# Altium project VoIP.PrjPcb
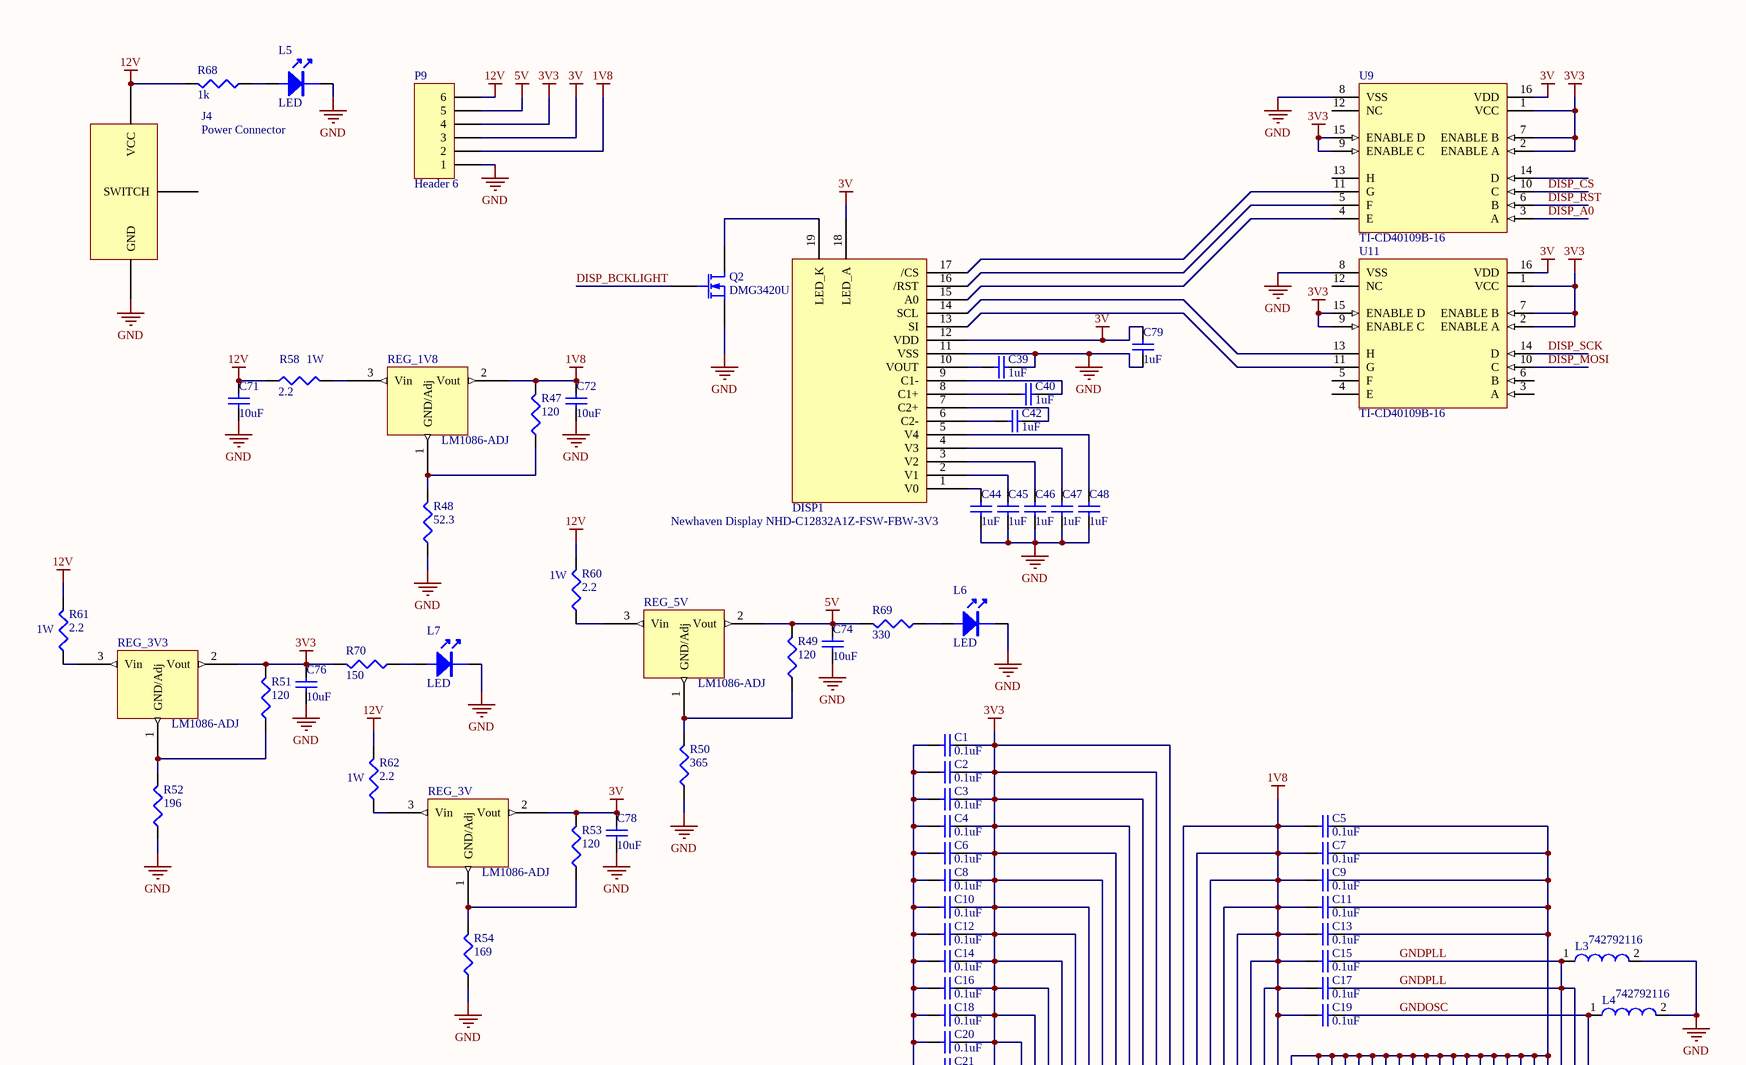
[diagram p0: Main.SchDoc, top left]
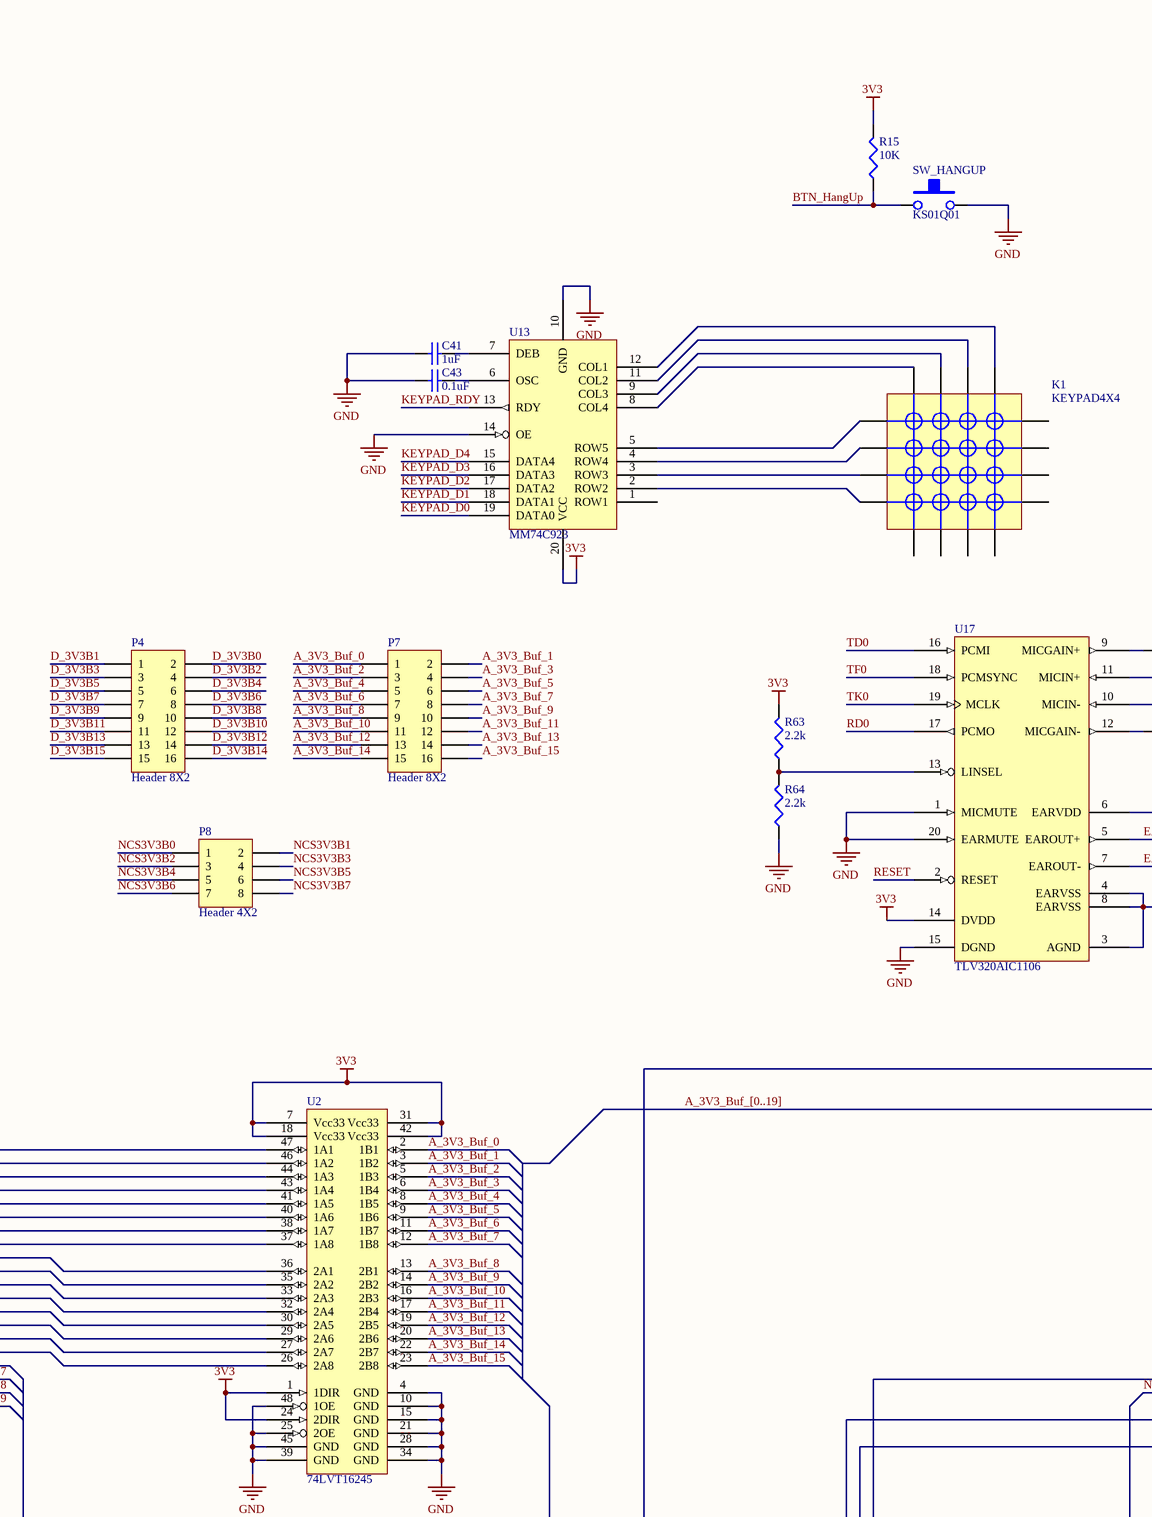
[diagram p1: Main.SchDoc, top middle]
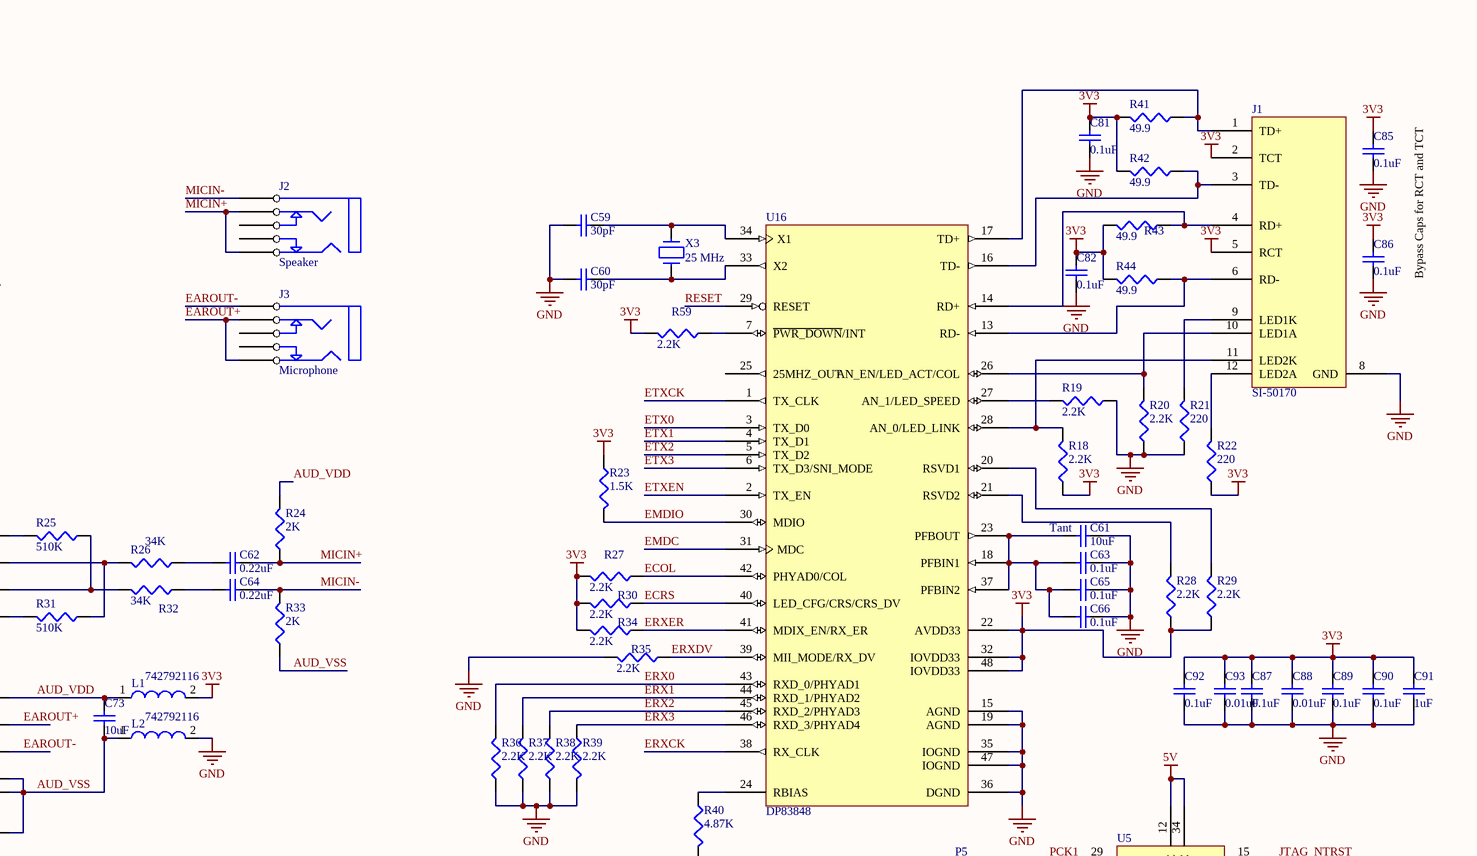
[diagram p2: Main.SchDoc, top right]
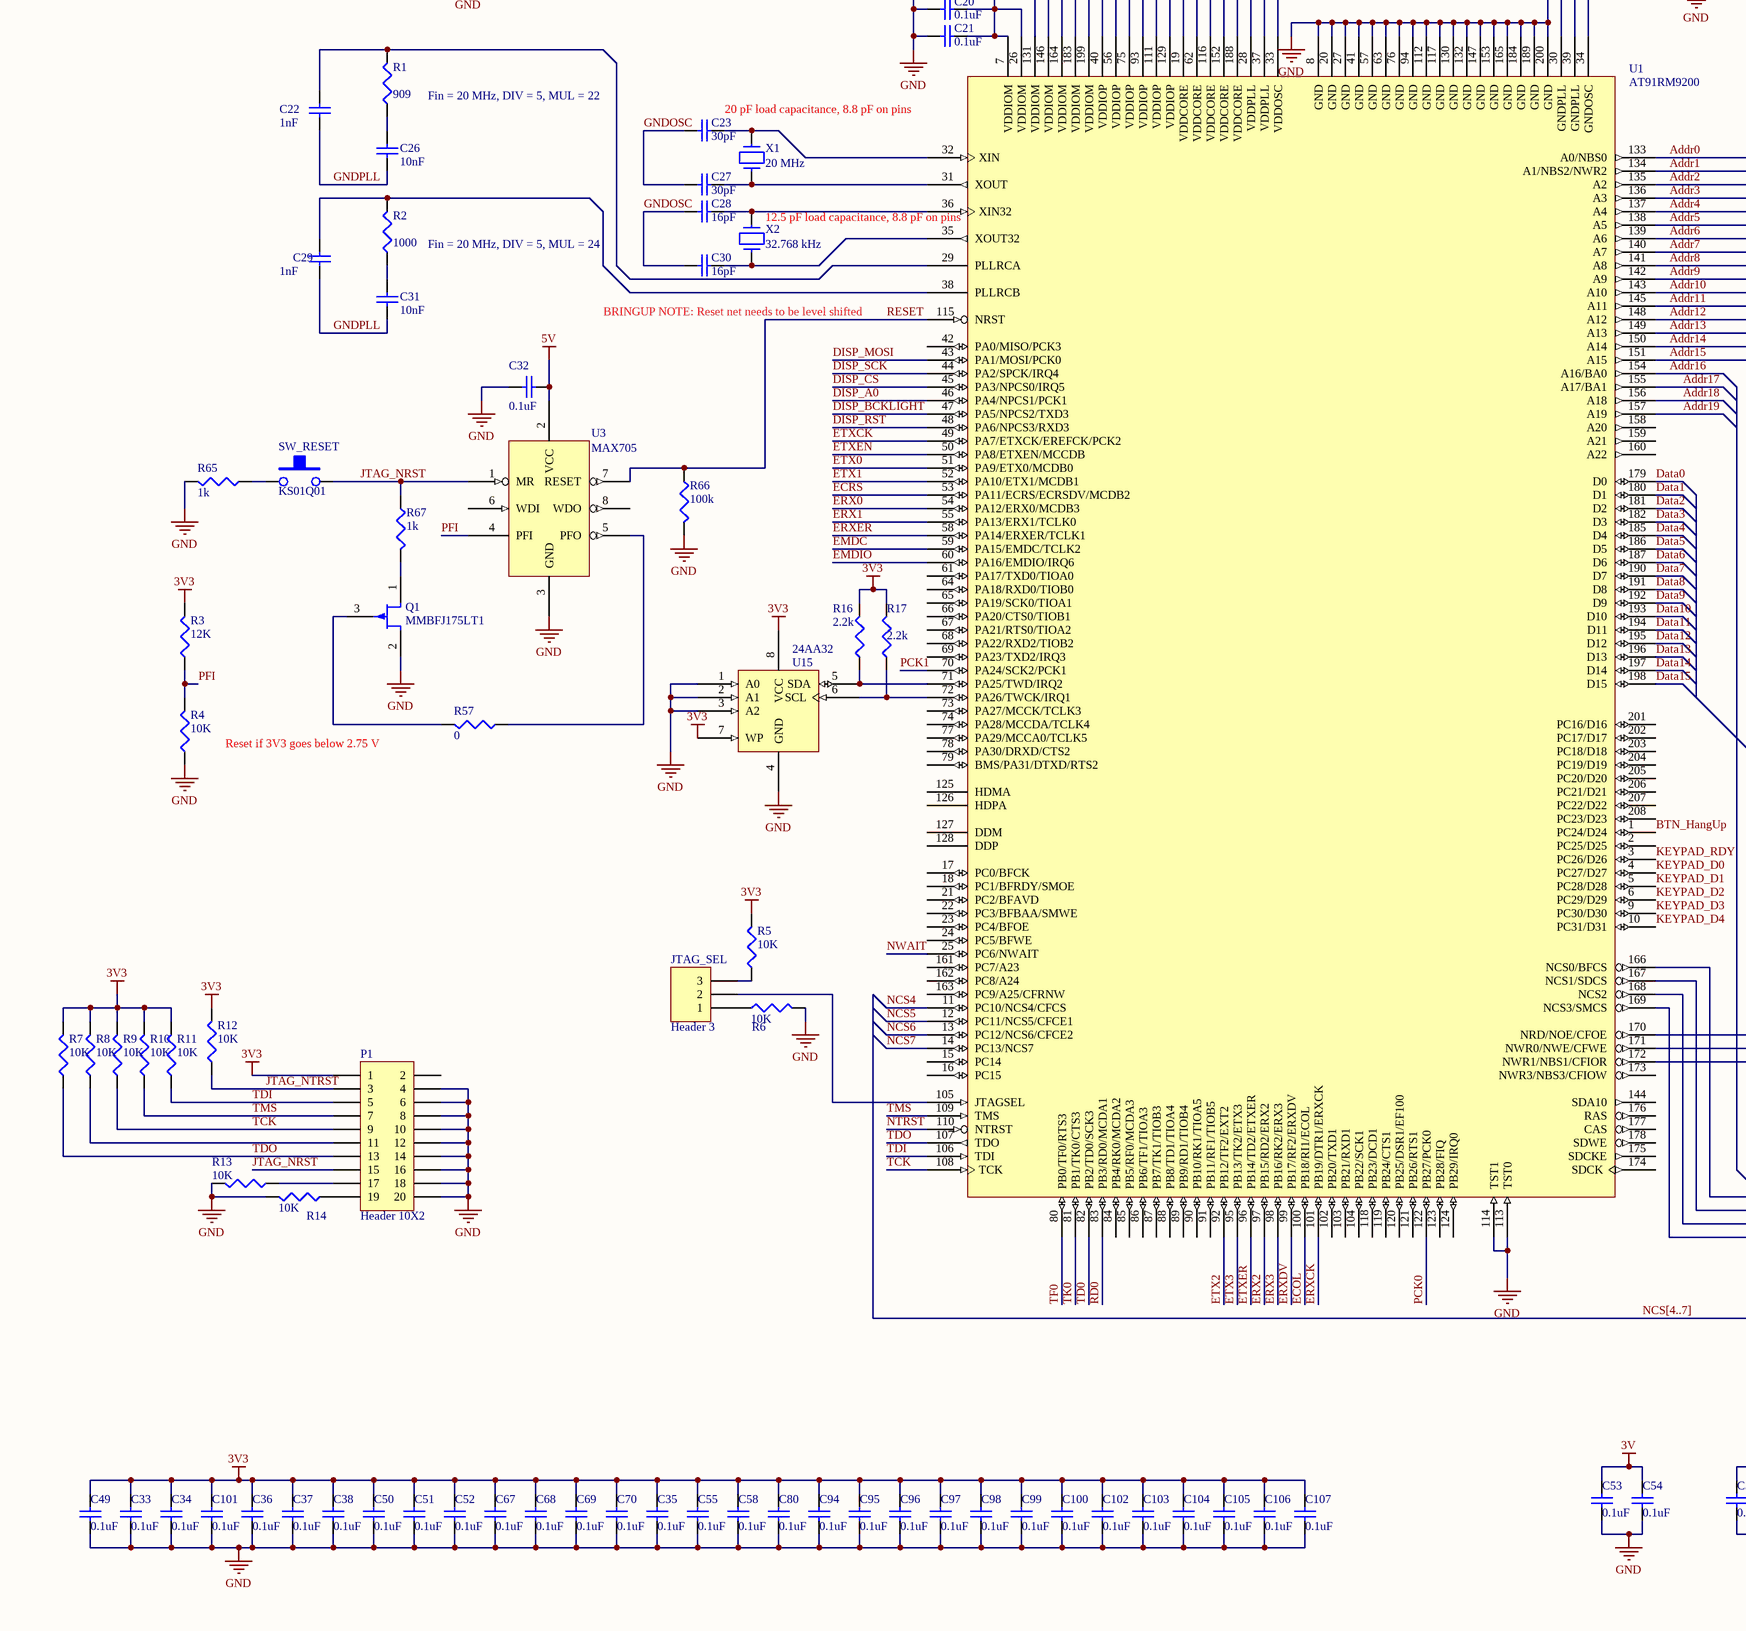
[diagram p3: Main.SchDoc, bottom left]
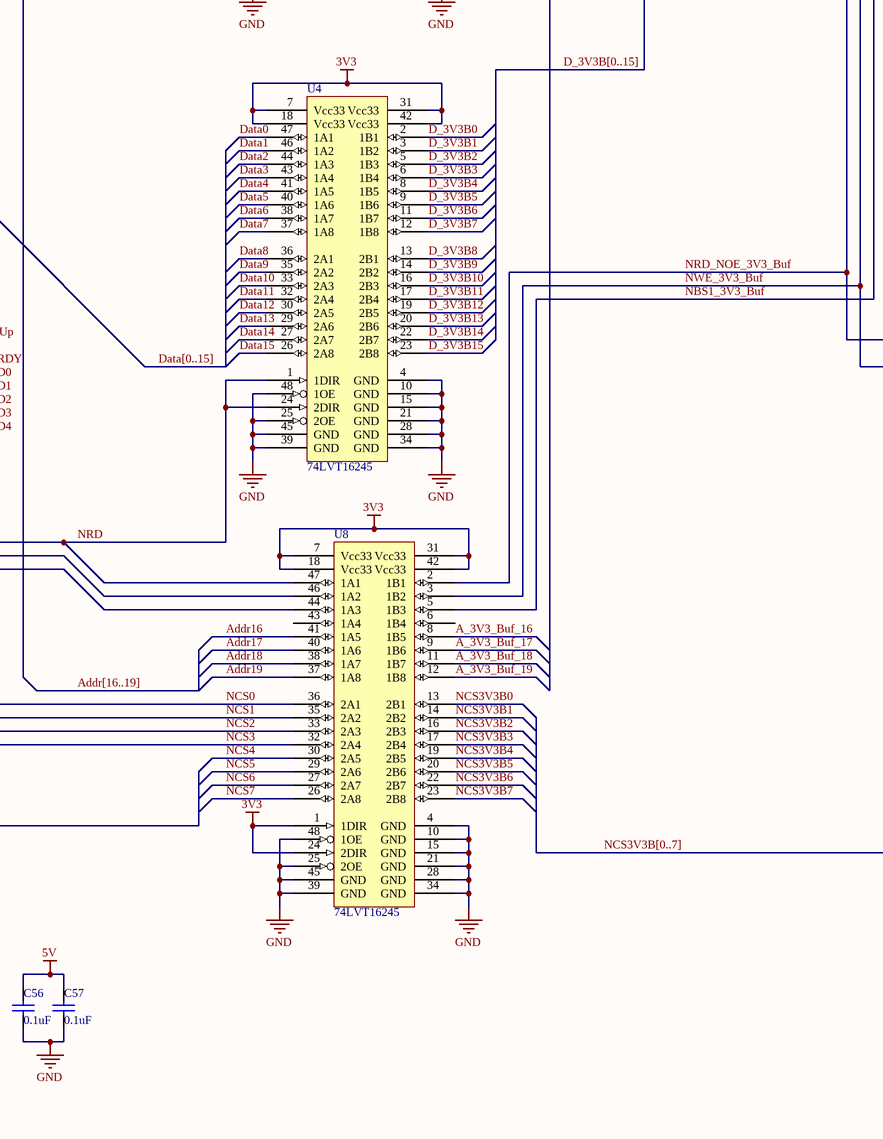
[diagram p4: Main.SchDoc, bottom middle]
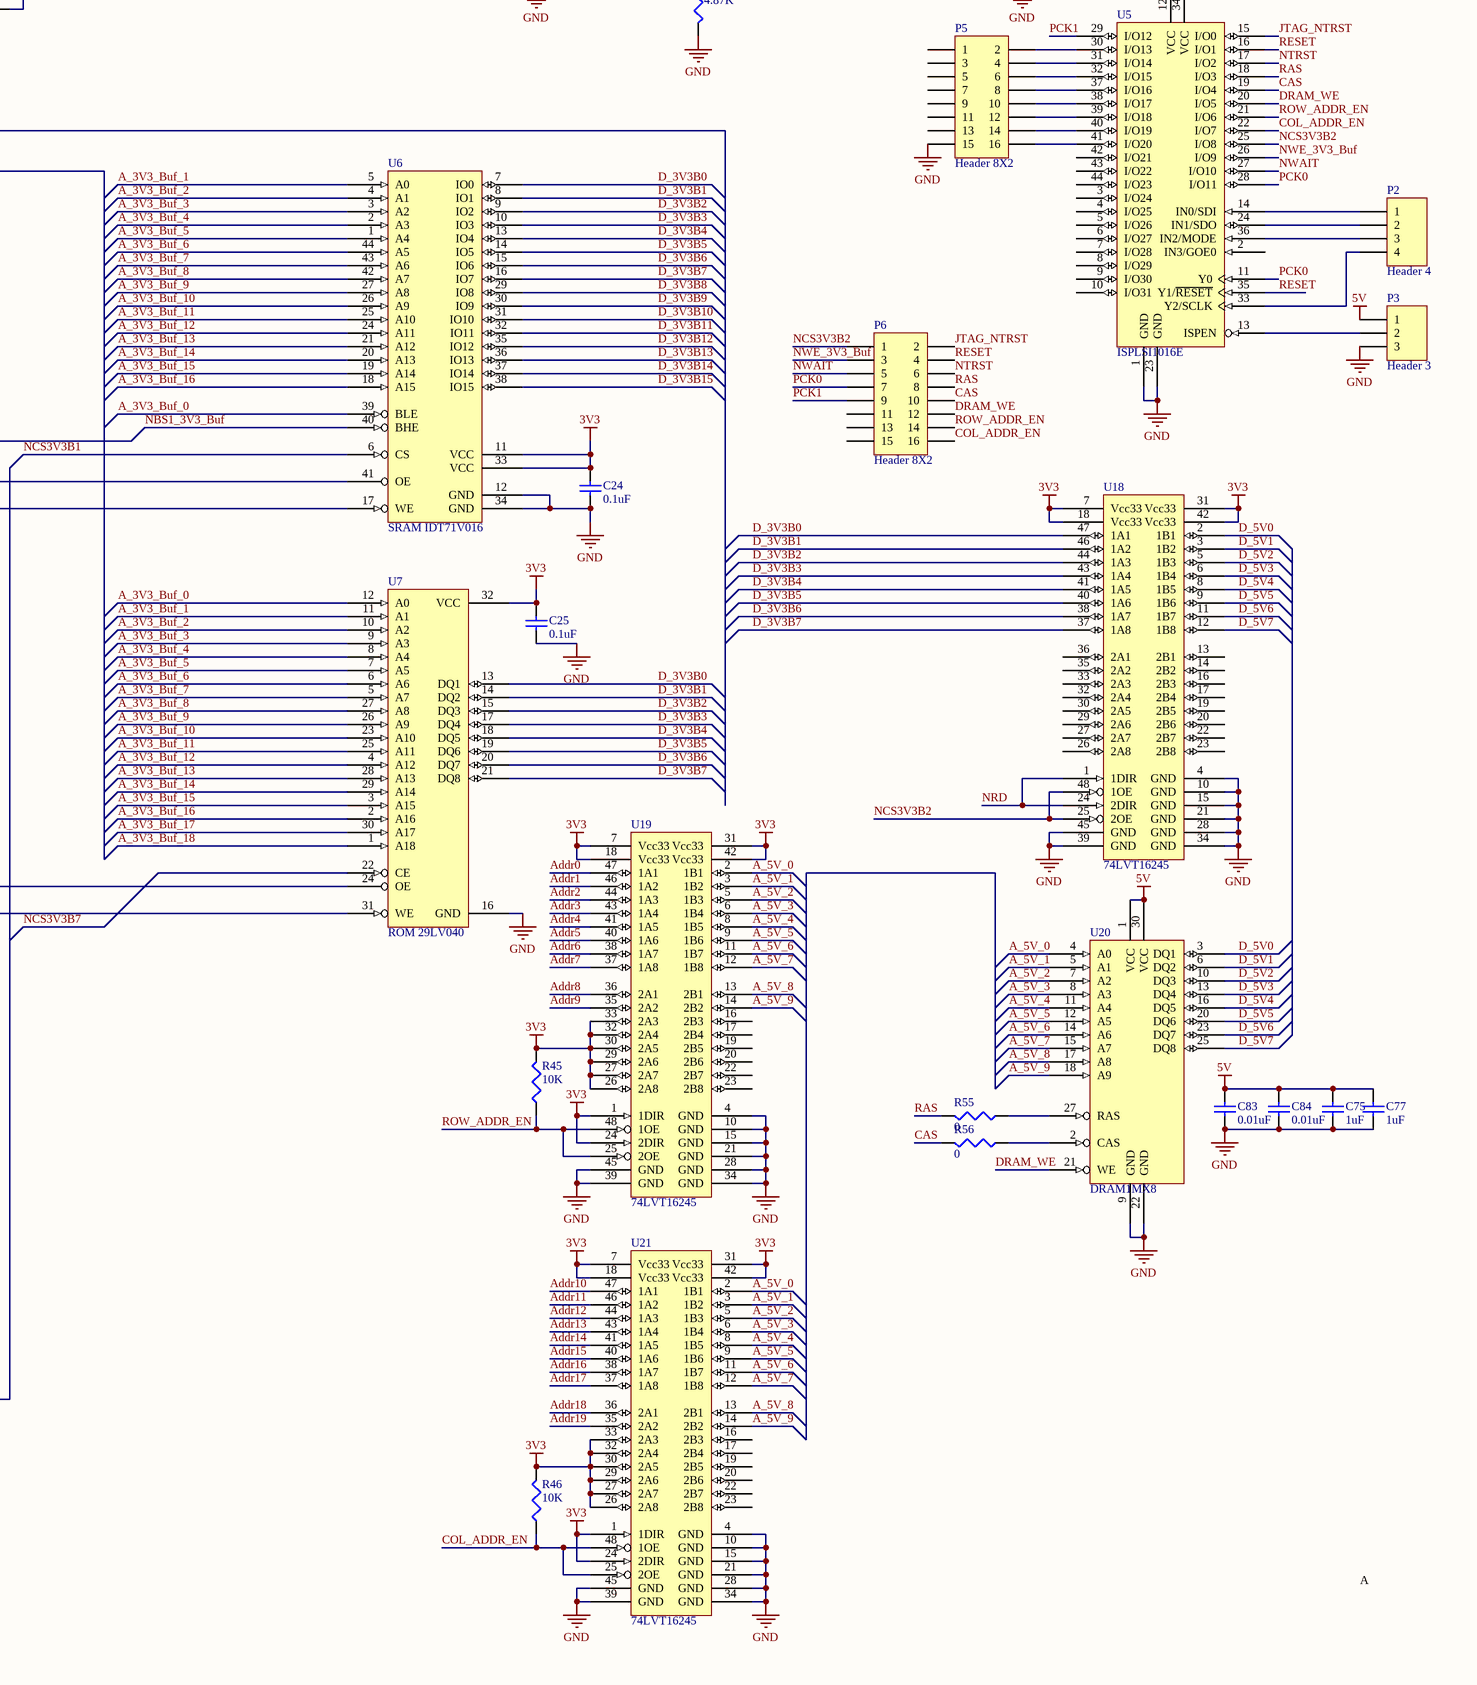
[diagram p5: Main.SchDoc, bottom right]
1 sheet, 229 parts. Net scope: global (net labels, ports and power ports of the same name join across sheets).
Board file: PCB.PcbDoc

## Sheet Main.SchDoc: Main
size D; Author: Will Werst; CompanyName: Caltech EE/CS 52; SheetNumber: 1; SheetTotal: 1

### Parts
C1  value 0.1uF  [1608[0603]]
C2  value 0.1uF  [1608[0603]]
C3  value 0.1uF  [1608[0603]]
C4  value 0.1uF  [1608[0603]]
C5  value 0.1uF  [1608[0603]]
C6  value 0.1uF  [1608[0603]]
C7  value 0.1uF  [1608[0603]]
C8  value 0.1uF  [1608[0603]]
C9  value 0.1uF  [1608[0603]]
C10  value 0.1uF  [1608[0603]]
C11  value 0.1uF  [1608[0603]]
C12  value 0.1uF  [1608[0603]]
C13  value 0.1uF  [1608[0603]]
C14  value 0.1uF  [1608[0603]]
C15  value 0.1uF  [1608[0603]]
C16  value 0.1uF  [1608[0603]]
C17  value 0.1uF  [1608[0603]]
C18  value 0.1uF  [1608[0603]]
C19  value 0.1uF  [1608[0603]]
C20  value 0.1uF  [1608[0603]]
C21  value 0.1uF  [1608[0603]]
C22  value 1nF  [1608[0603]]
C23  value 30pF  [1608[0603]]
C24  value 0.1uF  [1608[0603]]
C25  value 0.1uF  [1608[0603]]
C26  value 10nF  [1608[0603]]
C27  value 30pF  [1608[0603]]
C28  value 16pF  [1608[0603]]
C29  value 1nF  [1608[0603]]
C30  value 16pF  [1608[0603]]
C31  value 10nF  [1608[0603]]
C32  value 0.1uF  [1608[0603]]
C33  value 0.1uF  [1608[0603]]
C34  value 0.1uF  [1608[0603]]
C35  value 0.1uF  [1608[0603]]
C36  value 0.1uF  [1608[0603]]
C37  value 0.1uF  [1608[0603]]
C38  value 0.1uF  [1608[0603]]
C39  value 1uF  [1608[0603]]
C40  value 1uF  [1608[0603]]
C41  value 1uF  [1608[0603]]
C42  value 1uF  [1608[0603]]
C43  value 0.1uF  [1608[0603]]
C44  value 1uF  [1608[0603]]
C45  value 1uF  [1608[0603]]
C46  value 1uF  [1608[0603]]
C47  value 1uF  [1608[0603]]
C48  value 1uF  [1608[0603]]
C49  value 0.1uF  [1608[0603]]
C50  value 0.1uF  [1608[0603]]
C51  value 0.1uF  [1608[0603]]
C52  value 0.1uF  [1608[0603]]
C53  value 0.1uF  [1608[0603]]
C54  value 0.1uF  [1608[0603]]
C55  value 0.1uF  [1608[0603]]
C56  value 0.1uF  [1608[0603]]
C57  value 0.1uF  [1608[0603]]
C58  value 0.1uF  [1608[0603]]
C59  value 30pF  [1608[0603]]
C60  value 30pF  [1608[0603]]
C61  Tant  value 10uF  [C1206]
C62  value 0.22uF  [1608[0603]]
C63  value 0.1uF  [1608[0603]]
C64  value 0.22uF  [1608[0603]]
C65  value 0.1uF  [1608[0603]]
C66  value 0.1uF  [1608[0603]]
C67  value 0.1uF  [1608[0603]]
C68  value 0.1uF  [1608[0603]]
C69  value 0.1uF  [1608[0603]]
C70  value 0.1uF  [1608[0603]]
C71  value 10uF  [C1206]
C72  value 10uF  [C1206]
C73  value 10uF  [C1206]
C74  value 10uF  [C1206]
C75  value 1uF  [1608[0603]]
C76  value 10uF  [C1206]
C77  value 1uF  [1608[0603]]
C78  value 10uF  [C1206]
C79  value 1uF  [1608[0603]]
C80  value 0.1uF  [1608[0603]]
C81  value 0.1uF  [1608[0603]]
C82  value 0.1uF  [1608[0603]]
C83  value 0.01uF  [1608[0603]]
C84  value 0.01uF  [1608[0603]]
C85  value 0.1uF  [1608[0603]]
C86  value 0.1uF  [1608[0603]]
C87  value 0.1uF  [1608[0603]]
C88  value 0.01uF  [1608[0603]]
C89  value 0.1uF  [1608[0603]]
C90  value 0.1uF  [1608[0603]]
C91  value 1uF  [1608[0603]]
C92  value 0.1uF  [1608[0603]]
C93  value 0.01uF  [1608[0603]]
C94  value 0.1uF  [1608[0603]]
C95  value 0.1uF  [1608[0603]]
C96  value 0.1uF  [1608[0603]]
C97  value 0.1uF  [1608[0603]]
C98  value 0.1uF  [1608[0603]]
C99  value 0.1uF  [1608[0603]]
C100  value 0.1uF  [1608[0603]]
C101  value 0.1uF  [1608[0603]]
C102  value 0.1uF  [1608[0603]]
C103  value 0.1uF  [1608[0603]]
C104  value 0.1uF  [1608[0603]]
C105  value 0.1uF  [1608[0603]]
C106  value 0.1uF  [1608[0603]]
C107  value 0.1uF  [1608[0603]]
DISP1  Newhaven Display NHD-C12832A1Z-FSW-FBW-3V3  [PCB-1539121-1]
J1  SI-50170  [SI51070]
J2  Speaker  [SJ1-352]
J3  Microphone  [SJ1-352]
J4  Power Connector  [EJ508A]
JTAG_SEL  Header 3  [HDR1X3]
K1  KEYPAD4X4  [SIP8]
L1  742792116  [SMD-1206]
L2  742792116  [SMD-1206]
L3  742792116  [SMD-1206]
L4  742792116  [SMD-1206]
L5  LED  [LTST-C191KFKT]
L6  LED  [LTST-C191KFKT]
L7  LED  [LTST-C191KFKT]
P1  Header 10X2  [HDR2X10]
P2  Header 4  [HDR1X4]
P3  Header 3  [HDR1X3]
P4  Header 8X2  [HDR2X8]
P5  Header 8X2  [HDR2X8]
P6  Header 8X2  [HDR2X8]
P7  Header 8X2  [HDR2X8]
P8  Header 4X2  [HDR2X4]
P9  Header 6  [HDR1X6]
Q1  MMBFJ175LT1  [ONSC-SOT-23-3-318-08_V]
Q2  DMG3420U  [SOT23]
R1  value 909  [J1-0603]  (hidden comment: Res3)
R2  value 1000  [J1-0603]  (hidden comment: Res3)
R3  value 12K  [J1-0603]  (hidden comment: Res3)
R4  value 10K  [J1-0603]  (hidden comment: Res3)
R5  value 10K  [J1-0603]  (hidden comment: Res3)
R6  value 10K  [J1-0603]  (hidden comment: Res3)
R7  value 10K  [J1-0603]  (hidden comment: Res3)
R8  value 10K  [J1-0603]  (hidden comment: Res3)
R9  value 10K  [J1-0603]  (hidden comment: Res3)
R10  value 10K  [J1-0603]  (hidden comment: Res3)
R11  value 10K  [J1-0603]  (hidden comment: Res3)
R12  value 10K  [J1-0603]  (hidden comment: Res3)
R13  value 10K  [J1-0603]  (hidden comment: Res3)
R14  value 10K  [J1-0603]  (hidden comment: Res3)
R15  value 10K  [J1-0603]  (hidden comment: Res3)
R16  value 2.2k  [J1-0603]  (hidden comment: Res3)
R17  value 2.2k  [J1-0603]  (hidden comment: Res3)
R18  value 2.2K  [J1-0603]  (hidden comment: Res3)
R19  value 2.2K  [J1-0603]  (hidden comment: Res3)
R20  value 2.2K  [J1-0603]  (hidden comment: Res3)
R21  value 220  [J1-0603]  (hidden comment: Res3)
R22  value 220  [J1-0603]  (hidden comment: Res3)
R23  value 1.5K  [J1-0603]  (hidden comment: Res3)
R24  value 2K  [J1-0603]  (hidden comment: Res3)
R25  value 510K  [J1-0603]  (hidden comment: Res3)
R26  value 34K  [J1-0603]  (hidden comment: Res3)
R27  value 2.2K  [J1-0603]  (hidden comment: Res3)
R28  value 2.2K  [J1-0603]  (hidden comment: Res3)
R29  value 2.2K  [J1-0603]  (hidden comment: Res3)
R30  value 2.2K  [J1-0603]  (hidden comment: Res3)
R31  value 510K  [J1-0603]  (hidden comment: Res3)
R32  value 34K  [J1-0603]  (hidden comment: Res3)
R33  value 2K  [J1-0603]  (hidden comment: Res3)
R34  value 2.2K  [J1-0603]  (hidden comment: Res3)
R35  value 2.2K  [J1-0603]  (hidden comment: Res3)
R36  value 2.2K  [J1-0603]  (hidden comment: Res3)
R37  value 2.2K  [J1-0603]  (hidden comment: Res3)
R38  value 2.2K  [J1-0603]  (hidden comment: Res3)
R39  value 2.2K  [J1-0603]  (hidden comment: Res3)
R40  value 4.87K  [J1-0603]  (hidden comment: Res3)
R41  value 49.9  [J1-0603]  (hidden comment: Res3)
R42  value 49.9  [J1-0603]  (hidden comment: Res3)
R43  value 49.9  [J1-0603]  (hidden comment: Res3)
R44  value 49.9  [J1-0603]  (hidden comment: Res3)
R45  value 10K  [J1-0603]  (hidden comment: Res3)
R46  value 10K  [J1-0603]  (hidden comment: Res3)
R47  value 120  [J1-0603]  (hidden comment: Res3)
R48  value 52.3  [J1-0603]  (hidden comment: Res3)
R49  value 120  [J1-0603]  (hidden comment: Res3)
R50  value 365  [J1-0603]  (hidden comment: Res3)
R51  value 120  [J1-0603]  (hidden comment: Res3)
R52  value 196  [J1-0603]  (hidden comment: Res3)
R53  value 120  [J1-0603]  (hidden comment: Res3)
R54  value 169  [J1-0603]  (hidden comment: Res3)
R55  value 0  [J1-0603]  (hidden comment: Res3)
R56  value 0  [J1-0603]  (hidden comment: Res3)
R57  value 0  [J1-0603]  (hidden comment: Res3)
R58  1W  value 2.2  [RESC6332]
R59  value 2.2K  [J1-0603]  (hidden comment: Res3)
R60  1W  value 2.2  [RESC6332]
R61  1W  value 2.2  [RESC6332]
R62  1W  value 2.2  [RESC6332]
R63  value 2.2k  [J1-0603]  (hidden comment: Res3)
R64  value 2.2k  [J1-0603]  (hidden comment: Res3)
R65  value 1k  [J1-0603]  (hidden comment: Res3)
R66  value 100k  [J1-0603]  (hidden comment: Res3)
R67  value 1k  [J1-0603]  (hidden comment: Res3)
R68  value 1k  [J1-0603]  (hidden comment: Res3)
R69  value 330  [J1-0603]  (hidden comment: Res3)
R70  value 150  [J1-0603]  (hidden comment: Res3)
REG_1V8  LM1086-ADJ  [TO-220V]
REG_3V  LM1086-ADJ  [TO-220V]
REG_3V3  LM1086-ADJ  [TO-220V]
REG_5V  LM1086-ADJ  [TO-220V]
SW_HANGUP  KS01Q01  [KS01Q01]
SW_RESET  KS01Q01  [KS01Q01]
U1  AT91RM9200  [PQFP208]
U2  74LVT16245  [TSSOP48]
U3  MAX705  [DIPS8]
U4  74LVT16245  [TSSOP48]
U5  ISPLSI1016E  [PLCCS44]
U6  SRAM IDT71V016  [SSOP44.400]
U7  ROM 29LV040  [PLCCS32]
U8  74LVT16245  [TSSOP48]
U9  TI-CD40109B-16  [TI-PW16_M]
U11  TI-CD40109B-16  [TI-PW16_M]
U13  MM74C923  [DIPS20]
U15  24AA32  [DIPS8]
U16  DP83848  [LQFP48]
U17  TLV320AIC1106  [PSOP20]
U18  74LVT16245  [TSSOP48]
U19  74LVT16245  [TSSOP48]
U20  DRAM1MX8  [SIMM30]
U21  74LVT16245  [TSSOP48]
X1  20 MHz  [HC-49U]
X2  32.768 kHz  [FX-3]
X3  25 MHz  [HC-49U]

### Nets
1V8: C5.2 C7.2 C9.2 C11.2 C13.2 C15.2 C17.2 C19.2 C72.2 P9.2 R47.2 REG_1V8.2(Vout) U1.19(VDDCORE) U1.28(VDDPLL) U1.33(VDDOSC) U1.37(VDDPLL) U1.62(VDDCORE) U1.116(VDDCORE) U1.152(VDDCORE) U1.188(VDDCORE)
3V: C53.1 C54.1 C78.2 C79.2 DISP1.12(VDD) DISP1.18(LED_A) P9.3 R53.2 REG_3V.2(Vout) U9.16(VDD) U11.16(VDD)
3V3: C1.1 C2.1 C3.1 C4.1 C6.1 C8.1 C10.1 C12.1 C14.1 C16.1 C18.1 C20.1 C21.1 C24.1 C25.1 C32.1 C33.1 C34.1 C35.1 C36.1 C37.1 C38.1 C49.1 C50.1 C51.1 C52.1 C55.1 C56.1 C57.1 C58.1 C67.1 C68.1 C69.1 C70.1 C74.2 C75.1 C76.2 C77.1 C80.1 C81.1 C82.1 C83.1 C84.1 C85.1 C86.1 C87.1 C88.1 C89.1 C90.1 C91.1 C92.1 C93.1 C94.1 C95.1 C96.1 C97.1 C98.1 C99.1 C100.1 C101.1 C102.1 C103.1 C104.1 C105.1 C106.1 C107.1 J1.2(TCT) J1.5(RCT) L1.2 P1.1 P3.1 P9.4 P9.5 R3.2 R5.2 R7.2 R8.2 R9.2 R10.2 R11.2 R12.2 R15.2 R16.2 R17.2 R18.1 R22.1 R23.1 R27.2 R28.1 R29.1 R30.2 R34.2 R41.2 R42.2 R43.2 R44.2 R45.2 R46.2 R49.2 R51.2 R59.2 R63.2 R69.2 R70.2 REG_3V3.2(Vout) REG_5V.2(Vout) U1.7(VDDIOM) U1.26(VDDIOM) U1.40(VDDIOP) U1.56(VDDIOP) U1.75(VDDIOP) U1.93(VDDIOP) U1.111(VDDIOP) U1.129(VDDIOP) U1.131(VDDIOM) U1.146(VDDIOM) U1.164(VDDIOM) U1.183(VDDIOM) U1.199(VDDIOM) U2.1(1DIR) U2.7(Vcc33) U2.18(Vcc33) U2.24(2DIR) U2.31(Vcc33) U2.42(Vcc33) U3.2(VCC) U4.7(Vcc33) U4.18(Vcc33) U4.31(Vcc33) U4.42(Vcc33) U5.12(VCC) U5.34(VCC) U6.11(VCC) U6.33(VCC) U7.32(VCC) U8.1(1DIR) U8.7(Vcc33) U8.18(Vcc33) U8.24(2DIR) U8.31(Vcc33) U8.42(Vcc33) U9.1(VCC) U9.2(ENABLE_A) U9.7(ENABLE_B) U9.9(ENABLE_C) U9.15(ENABLE_D) U11.1(VCC) U11.2(ENABLE_A) U11.7(ENABLE_B) U11.9(ENABLE_C) U11.15(ENABLE_D) U13.20(VCC) U15.7(WP) U15.8(VCC) U16.22(AVDD33) U16.32(IOVDD33) U16.48(IOVDD33) U17.14(DVDD) U18.7(Vcc33) U18.18(Vcc33) U18.31(Vcc33) U18.42(Vcc33) U19.1(1DIR) U19.7(Vcc33) U19.18(Vcc33) U19.24(2DIR) U19.26(2A8) U19.27(2A7) U19.29(2A6) U19.30(2A5) U19.31(Vcc33) U19.32(2A4) U19.33(2A3) U19.42(Vcc33) U20.1(VCC) U20.30(VCC) U21.1(1DIR) U21.7(Vcc33) U21.18(Vcc33) U21.24(2DIR) U21.26(2A8) U21.27(2A7) U21.29(2A6) U21.30(2A5) U21.31(Vcc33) U21.32(2A4) U21.33(2A3) U21.42(Vcc33)  [also labelled 5V, VCC, Vcc33]
12V: C71.2 J4.VCC P9.6 R58.1 R60.2 R61.2 R62.2 R68.2
GND: C1.2 C2.2 C3.2 C4.2 C5.1 C6.2 C7.1 C8.2 C9.1 C10.2 C11.1 C12.2 C13.1 C14.2 C16.2 C18.2 C20.2 C21.2 C24.2 C25.2 C32.2 C33.2 C34.2 C35.2 C36.2 C37.2 C38.2 C39.2 C41.2 C43.2 C44.1 C45.1 C46.1 C47.1 C48.1 C49.2 C50.2 C51.2 C52.2 C53.2 C54.2 C55.2 C56.2 C57.2 C58.2 C59.2 C60.2 C61.2 C63.2 C65.2 C66.2 C67.2 C68.2 C69.2 C70.2 C71.1 C72.1 C74.1 C75.2 C76.1 C77.2 C78.1 C79.1 C80.2 C81.2 C82.2 C83.2 C84.2 C85.2 C86.2 C87.2 C88.2 C89.2 C90.2 C91.2 C92.2 C93.2 C94.2 C95.2 C96.2 C97.2 C98.2 C99.2 C100.2 C101.2 C102.2 C103.2 C104.2 C105.2 C106.2 C107.2 DISP1.11(VSS) J1.8(GND) J4.GND L2.2 L3.2 L4.2 L5.K L6.K L7.K P1.4 P1.6 P1.8 P1.10 P1.12 P1.14 P1.16 P1.18 P1.20 P3.3 P5.15 P9.1 Q1.2(S) Q2.S R4.1 R6.2 R13.2 R14.2 R19.1 R20.1 R21.1 R35.2 R36.1 R37.1 R38.1 R39.2 R40.2 R48.1 R50.1 R52.1 R54.1 R64.1 R65.2 R66.2 SW_HANGUP.2 U1.8(GND) U1.20(GND) U1.27(GND) U1.41(GND) U1.57(GND) U1.63(GND) U1.76(GND) U1.94(GND) U1.112(GND) U1.113(TST0) U1.114(TST1) U1.117(GND) U1.130(GND) U1.132(GND) U1.147(GND) U1.153(GND) U1.165(GND) U1.184(GND) U1.189(GND) U1.200(GND) U2.4(GND) U2.10(GND) U2.15(GND) U2.21(GND) U2.25(2OE) U2.28(GND) U2.34(GND) U2.39(GND) U2.45(GND) U2.48(1OE) U3.3(GND) U4.4(GND) U4.10(GND) U4.15(GND) U4.21(GND) U4.25(2OE) U4.28(GND) U4.34(GND) U4.39(GND) U4.45(GND) U4.48(1OE) U5.1(GND) U5.23(GND) U6.12(GND) U6.34(GND) U7.16(GND) U8.4(GND) U8.10(GND) U8.15(GND) U8.21(GND) U8.25(2OE) U8.28(GND) U8.34(GND) U8.39(GND) U8.45(GND) U8.48(1OE) U9.8(VSS) U11.8(VSS) U13.10(GND) U13.14(OE) U15.1(A0) U15.2(A1) U15.3(A2) U15.4(GND) U16.15(AGND) U16.19(AGND) U16.35(IOGND) U16.36(DGND) U16.47(IOGND) U17.1(MICMUTE) U17.15(DGND) U17.20(EARMUTE) U18.4(GND) U18.10(GND) U18.15(GND) U18.21(GND) U18.28(GND) U18.34(GND) U18.39(GND) U18.45(GND) U19.4(GND) U19.10(GND) U19.15(GND) U19.21(GND) U19.28(GND) U19.34(GND) U19.39(GND) U19.45(GND) U20.9(GND) U20.22(GND) U21.4(GND) U21.10(GND) U21.15(GND) U21.21(GND) U21.28(GND) U21.34(GND) U21.39(GND) U21.45(GND)
A_3V3_Buf_0: P7.1 U2.2(1B1) U6.39(BLE) U7.12(A0)
A_3V3_Buf_1: P7.2 U2.3(1B2) U6.5(A0) U7.11(A1)
A_3V3_Buf_2: P7.3 U2.5(1B3) U6.4(A1) U7.10(A2)
A_3V3_Buf_3: P7.4 U2.6(1B4) U6.3(A2) U7.9(A3)
A_3V3_Buf_4: P7.5 U2.8(1B5) U6.2(A3) U7.8(A4)
A_3V3_Buf_5: P7.6 U2.9(1B6) U6.1(A4) U7.7(A5)
A_3V3_Buf_6: P7.7 U2.11(1B7) U6.44(A5) U7.6(A6)
A_3V3_Buf_7: P7.8 U2.12(1B8) U6.43(A6) U7.5(A7)
A_3V3_Buf_8: P7.9 U2.13(2B1) U6.42(A7) U7.27(A8)
A_3V3_Buf_9: P7.10 U2.14(2B2) U6.27(A8) U7.26(A9)
A_3V3_Buf_10: P7.11 U2.16(2B3) U6.26(A9) U7.23(A10)
A_3V3_Buf_11: P7.12 U2.17(2B4) U6.25(A10) U7.25(A11)
A_3V3_Buf_12: P7.13 U2.19(2B5) U6.24(A11) U7.4(A12)
A_3V3_Buf_13: P7.14 U2.20(2B6) U6.21(A12) U7.28(A13)
A_3V3_Buf_14: P7.15 U2.22(2B7) U6.20(A13) U7.29(A14)
A_3V3_Buf_15: P7.16 U2.23(2B8) U6.19(A14) U7.3(A15)
A_3V3_Buf_16: U6.18(A15) U7.2(A16) U8.8(1B5)
A_3V3_Buf_17: U7.30(A17) U8.9(1B6)
A_3V3_Buf_18: U7.1(A18) U8.11(1B7)
A_3V3_Buf_19: U8.12(1B8)
A_5V_0: U19.2(1B1) U20.4(A0) U21.2(1B1)
A_5V_1: U19.3(1B2) U20.5(A1) U21.3(1B2)
A_5V_2: U19.5(1B3) U20.7(A2) U21.5(1B3)
A_5V_3: U19.6(1B4) U20.8(A3) U21.6(1B4)
A_5V_4: U19.8(1B5) U20.11(A4) U21.8(1B5)
A_5V_5: U19.9(1B6) U20.12(A5) U21.9(1B6)
A_5V_6: U19.11(1B7) U20.14(A6) U21.11(1B7)
A_5V_7: U19.12(1B8) U20.15(A7) U21.12(1B8)
A_5V_8: U19.13(2B1) U20.17(A8) U21.13(2B1)
A_5V_9: U19.14(2B2) U20.18(A9) U21.14(2B2)
Addr0: U1.133(A0/NBS0) U2.47(1A1) U19.47(1A1)
Addr1: U1.134(A1/NBS2/NWR2) U2.46(1A2) U19.46(1A2)
Addr2: U1.135(A2) U2.44(1A3) U19.44(1A3)
Addr3: U1.136(A3) U2.43(1A4) U19.43(1A4)
Addr4: U1.137(A4) U2.41(1A5) U19.41(1A5)
Addr5: U1.138(A5) U2.40(1A6) U19.40(1A6)
Addr6: U1.139(A6) U2.38(1A7) U19.38(1A7)
Addr7: U1.140(A7) U2.37(1A8) U19.37(1A8)
Addr8: U1.141(A8) U2.36(2A1) U19.36(2A1)
Addr9: U1.142(A9) U2.35(2A2) U19.35(2A2)
Addr10: U1.143(A10) U2.33(2A3) U21.47(1A1)
Addr11: U1.145(A11) U2.32(2A4) U21.46(1A2)
Addr12: U1.148(A12) U2.30(2A5) U21.44(1A3)
Addr13: U1.149(A13) U2.29(2A6) U21.43(1A4)
Addr14: U1.150(A14) U2.27(2A7) U21.41(1A5)
Addr15: U1.151(A15) U2.26(2A8) U21.40(1A6)
Addr16: U1.154(A16/BA0) U8.41(1A5) U21.38(1A7)
Addr17: U1.155(A17/BA1) U8.40(1A6) U21.37(1A8)
Addr18: U1.156(A18) U8.38(1A7) U21.36(2A1)
Addr19: U1.157(A19) U8.37(1A8) U21.35(2A2)
AUD_VDD: C73.2 L1.1 R24.2 U17.6(EARVDD)
AUD_VSS: C73.1 L2.1 R33.1 U17.3(AGND) U17.4(EARVSS) U17.8(EARVSS)
BTN_HangUp: R15.1 SW_HANGUP.1 U1.1(PC24/D24)
CAS: P6.10 R56.2 U5.19(I/O4)
COL_ADDR_EN: P6.16 R46.1 U5.22(I/O7) U21.25(2OE) U21.48(1OE)
D_3V3B0: P4.2 U4.2(1B1) U6.7(IO0) U7.13(DQ1) U18.47(1A1)
D_3V3B1: P4.1 U4.3(1B2) U6.8(IO1) U7.14(DQ2) U18.46(1A2)
D_3V3B2: P4.4 U4.5(1B3) U6.9(IO2) U7.15(DQ3) U18.44(1A3)
D_3V3B3: P4.3 U4.6(1B4) U6.10(IO3) U7.17(DQ4) U18.43(1A4)
D_3V3B4: P4.6 U4.8(1B5) U6.13(IO4) U7.18(DQ5) U18.41(1A5)
D_3V3B5: P4.5 U4.9(1B6) U6.14(IO5) U7.19(DQ6) U18.40(1A6)
D_3V3B6: P4.8 U4.11(1B7) U6.15(IO6) U7.20(DQ7) U18.38(1A7)
D_3V3B7: P4.7 U4.12(1B8) U6.16(IO7) U7.21(DQ8) U18.37(1A8)
D_3V3B8: P4.10 U4.13(2B1) U6.29(IO8)
D_3V3B9: P4.9 U4.14(2B2) U6.30(IO9)
D_3V3B10: P4.12 U4.16(2B3) U6.31(IO10)
D_3V3B11: P4.11 U4.17(2B4) U6.32(IO11)
D_3V3B12: P4.14 U4.19(2B5) U6.35(IO12)
D_3V3B13: P4.13 U4.20(2B6) U6.36(IO13)
D_3V3B14: P4.16 U4.22(2B7) U6.37(IO14)
D_3V3B15: P4.15 U4.23(2B8) U6.38(IO15)
D_5V0: U18.2(1B1) U20.3(DQ1)
D_5V1: U18.3(1B2) U20.6(DQ2)
D_5V2: U18.5(1B3) U20.10(DQ3)
D_5V3: U18.6(1B4) U20.13(DQ4)
D_5V4: U18.8(1B5) U20.16(DQ5)
D_5V5: U18.9(1B6) U20.20(DQ6)
D_5V6: U18.11(1B7) U20.23(DQ7)
D_5V7: U18.12(1B8) U20.25(DQ8)
Data0: U1.179(D0) U4.47(1A1)
Data1: U1.180(D1) U4.46(1A2)
Data2: U1.181(D2) U4.44(1A3)
Data3: U1.182(D3) U4.43(1A4)
Data4: U1.185(D4) U4.41(1A5)
Data5: U1.186(D5) U4.40(1A6)
Data6: U1.187(D6) U4.38(1A7)
Data7: U1.190(D7) U4.37(1A8)
Data8: U1.191(D8) U4.36(2A1)
Data9: U1.192(D9) U4.35(2A2)
Data10: U1.193(D10) U4.33(2A3)
Data11: U1.194(D11) U4.32(2A4)
Data12: U1.195(D12) U4.30(2A5)
Data13: U1.196(D13) U4.29(2A6)
Data14: U1.197(D14) U4.27(2A7)
Data15: U1.198(D15) U4.26(2A8)
DISP_A0: U1.46(PA4/NPCS1/PCK1) U9.3(A)
DISP_BCKLIGHT: Q2.G U1.47(PA5/NPCS2/TXD3)
DISP_CS: U1.45(PA3/NPCS0/IRQ5) U9.10(C)
DISP_MOSI: U1.43(PA1/MOSI/PCK0) U11.10(C)
DISP_RST: U1.48(PA6/NPCS3/RXD3) U9.6(B)
DISP_SCK: U1.44(PA2/SPCK/IRQ4) U11.14(D)
DRAM_WE: P6.12 U5.20(I/O5) U20.21(WE)
EAROUT+: J3.A(RING) J3.D(TIP) U17.5(EAROUT+)
EAROUT-: J3.E(SLEEVE) U17.7(EAROUT-)
ECOL: R27.1 U1.100(PB18/RI1/ECOL) U16.42(PHYAD0/COL)
ECRS: R30.1 U1.53(PA11/ECRS/ECRSDV/MCDB2) U16.40(LED_CFG/CRS/CRS_DV)
EMDC: U1.59(PA15/EMDC/TCLK2) U16.31(MDC)
EMDIO: R23.2 U1.60(PA16/EMDIO/IRQ6) U16.30(MDIO)
ERX0: R36.2 U1.54(PA12/ERX0/MCDB3) U16.43(RXD_0/PHYAD1)
ERX1: R37.2 U1.55(PA13/ERX1/TCLK0) U16.44(RXD_1/PHYAD2)
ERX2: R38.2 U1.97(PB15/RD2/ERX2) U16.45(RXD_2/PHYAD3)
ERX3: R39.1 U1.98(PB16/RK2/ERX3) U16.46(RXD_3/PHYAD4)
ERXCK: U1.101(PB19/DTR1/ERXCK) U16.38(RX_CLK)
ERXDV: R35.1 U1.99(PB17/RF2/ERXDV) U16.39(MII_MODE/RX_DV)
ERXER: R34.1 U1.58(PA14/ERXER/TCLK1) U16.41(MDIX_EN/RX_ER)
ETX0: U1.51(PA9/ETX0/MCDB0) U16.3(TX_D0)
ETX1: U1.52(PA10/ETX1/MCDB1) U16.4(TX_D1)
ETX2: U1.92(PB12/TF2/EXT2) U16.5(TX_D2)
ETX3: U1.95(PB13/TK2/ETX3) U16.6(TX_D3/SNI_MODE)
ETXCK: U1.49(PA7/ETXCK/EREFCK/PCK2) U16.1(TX_CLK)
ETXEN: U1.50(PA8/ETXEN/MCCDB) U16.2(TX_EN)
ETXER: U1.96(PB14/TD2/ETXER)
GNDOSC: C19.1 C23.2 C27.2 C28.2 C30.2 L4.1 U1.34(GNDOSC)
GNDPLL: C15.1 C17.1 C22.2 C26.2 C29.2 C31.2 L3.1 U1.30(GNDPLL) U1.39(GNDPLL)
JTAG_NRST: P1.15 R67.1 SW_RESET.2 U3.1(MR)
JTAG_NTRST: P1.3 P6.2 R12.1 U5.15(I/O0)
KEYPAD_D0: U1.4(PC27/D27) U13.19(DATA0)
KEYPAD_D1: U1.5(PC28/D28) U13.18(DATA1)
KEYPAD_D2: U1.6(PC29/D29) U13.17(DATA2)
KEYPAD_D3: U1.9(PC30/D30) U13.16(DATA3)
KEYPAD_D4: U1.10(PC31/D31) U13.15(DATA4)
KEYPAD_RDY: U1.3(PC26/D26) U13.13(RDY)
MICIN+: C62.1 J2.A(RING) J2.D(TIP) R24.1
MICIN-: C64.1 J2.E(SLEEVE) R33.2
NBS1_3V3_Buf: U6.40(BHE) U8.5(1B3)
NCS0: U1.166(NCS0/BFCS) U8.36(2A1)
NCS1: U1.167(NCS1/SDCS) U8.35(2A2)
NCS2: U1.168(NCS2) U8.33(2A3)
NCS3: U1.169(NCS3/SMCS) U8.32(2A4)
NCS3V3B0: P8.1 U8.13(2B1)
NCS3V3B1: P8.2 U6.6(CS) U8.14(2B2)
NCS3V3B2: P6.1 P8.3 U5.25(I/O8) U8.16(2B3) U18.25(2OE) U18.48(1OE)
NCS3V3B3: P8.4 U8.17(2B4)
NCS3V3B4: P8.5 U8.19(2B5)
NCS3V3B5: P8.6 U8.20(2B6)
NCS3V3B6: P8.7 U8.22(2B7)
NCS3V3B7: P8.8 U7.22(CE) U8.23(2B8)
NCS4: U1.11(PC10/NCS4/CFCS) U8.30(2A5)
NCS5: U1.12(PC11/NCS5/CFCE1) U8.29(2A6)
NCS6: U1.13(PC12/NCS6/CFCE2) U8.27(2A7)
NCS7: U1.14(PC13/NCS7) U8.26(2A8)
NRD: U1.170(NRD/NOE/CFOE) U4.1(1DIR) U4.24(2DIR) U8.47(1A1) U18.1(1DIR) U18.24(2DIR)
NRD_NOE_3V3_Buf: U6.41(OE) U7.24(OE) U8.2(1B1)
NTRST: P6.6 U1.110(NTRST) U5.17(I/O2)
NWAIT: P6.5 U1.25(PC6/NWAIT) U5.27(I/O10)
NWE_3V3_Buf: P6.3 U5.26(I/O9) U6.17(WE) U7.31(WE) U8.3(1B2)
PCK0: P6.7 U1.122(PB27/PCK0) U5.11(Y0) U5.28(I/O11)
PCK1: P6.9 U1.70(PA24/SCK2/PCK1) U5.29(I/O12)
PFI: R3.1 R4.2 U3.4(PFI)
RAS: P6.8 R55.2 U5.18(I/O3)
RD0: U1.83(PB3/RD0/MCDA1) U17.17(PCMO)
RESET: P6.4 R66.1 U1.115(NRST) U3.7(RESET) U5.16(I/O1) U5.35(Y1/~{RESET}) U16.29(RESET) U17.2(RESET)
ROW_ADDR_EN: P6.14 R45.1 U5.21(I/O6) U19.25(2OE) U19.48(1OE)
TCK: P1.9 R9.1 U1.108(TCK)
TD0: U1.82(PB2/TD0/SCK3) U17.16(PCMI)
TDI: P1.5 R11.1 U1.106(TDI)
TDO: P1.13 R7.1 U1.107(TDO)
TF0: U1.80(PB0/TF0/RTS3) U17.18(PCMSYNC)
TK0: U1.81(PB1/TK0/CTS3) U17.19(MCLK)
TMS: P1.7 R10.1 U1.109(TMS)
NetC22_1: C22.1 R1.2 U1.29(PLLRCA)
NetC23_1: C23.1 U1.32(XIN) X1.2
NetC26_1: C26.1 R1.1
NetC27_1: C27.1 U1.31(XOUT) X1.1
NetC28_1: C28.1 U1.36(XIN32) X2.2
NetC29_1: C29.1 R2.2 U1.38(PLLRCB)
NetC30_1: C30.1 U1.35(XOUT32) X2.1
NetC31_1: C31.1 R2.1
NetC39_1: C39.1 DISP1.10(VOUT)
NetC40_1: C40.1 DISP1.8(C1+)
NetC40_2: C40.2 DISP1.9(C1-)
NetC41_1: C41.1 U13.7(DEB)
NetC42_1: C42.1 DISP1.6(C2-)
NetC42_2: C42.2 DISP1.7(C2+)
NetC43_1: C43.1 U13.6(OSC)
NetC44_2: C44.2 DISP1.1(V0)
NetC45_2: C45.2 DISP1.2(V1)
NetC46_2: C46.2 DISP1.3(V2)
NetC47_2: C47.2 DISP1.4(V3)
NetC48_2: C48.2 DISP1.5(V4)
NetC59_1: C59.1 U16.34(X1) X3.2
NetC60_1: C60.1 U16.33(X2) X3.1
NetC61_1: C61.1 C63.1 C65.1 C66.1 U16.18(PFBIN1) U16.23(PFBOUT) U16.37(PFBIN2)
NetC62_2: C62.2 R26.1
NetC64_2: C64.2 R32.1
NetDISP1_13: DISP1.13(SI) U11.11(G)
NetDISP1_14: DISP1.14(SCL) U11.13(H)
NetDISP1_15: DISP1.15(A0) U9.4(E)
NetDISP1_16: DISP1.16(/RST) U9.5(F)
NetDISP1_17: DISP1.17(/CS) U9.11(G)
NetDISP1_19: DISP1.19(LED_K) Q2.D
NetJ1_1: J1.1(TD+) R41.1 U16.17(TD+)
NetJ1_3: J1.3(TD-) R42.1 U16.16(TD-)
NetJ1_4: J1.4(RD+) R43.1 U16.14(RD+)
NetJ1_6: J1.6(RD-) R44.1 U16.13(RD-)
NetJ1_9: J1.9(LED1K) R21.2
NetJ1_10: J1.10(LED1A) R20.2 U16.26(AN_EN/LED_ACT/COL)
NetJ1_11: J1.11(LED2K) R18.2 U16.28(AN_0/LED_LINK)
NetJ1_12: J1.12(LED2A) R22.2
NetJTAG_SEL_1: JTAG_SEL.1 R6.1
NetJTAG_SEL_2: JTAG_SEL.2 U1.105(JTAGSEL)
NetJTAG_SEL_3: JTAG_SEL.3 R5.1
NetK1_1: K1.1(COL4) U13.12(COL1)
NetK1_2: K1.2(COL3) U13.11(COL2)
NetK1_3: K1.3(COL2) U13.9(COL3)
NetK1_4: K1.4(COL1) U13.8(COL4)
NetK1_5: K1.5(ROW4) U13.2(ROW2)
NetK1_6: K1.6(ROW3) U13.3(ROW3)
NetK1_7: K1.7(ROW2) U13.4(ROW4)
NetK1_8: K1.8(ROW1) U13.5(ROW5)
NetL5_A: L5.A R68.1
NetL6_A: L6.A R69.1
NetL7_A: L7.A R70.1
NetP1_11: P1.11 R8.1
NetP1_17: P1.17 R13.1
NetP1_19: P1.19 R14.1
NetP2_1: P2.1 U5.14(IN0/SDI)
NetP2_2: P2.2 U5.24(IN1/SDO)
NetP2_3: P2.3 U5.36(IN2/MODE)
NetP2_4: P2.4 U5.33(Y2/SCLK)
NetP3_2: P3.2 U5.13(ISPEN)
NetP5_2: P5.2 U5.30(I/O13)
NetP5_4: P5.4 U5.31(I/O14)
NetP5_6: P5.6 U5.32(I/O15)
NetP5_8: P5.8 U5.37(I/O16)
NetP5_10: P5.10 U5.38(I/O17)
NetP5_12: P5.12 U5.39(I/O18)
NetP5_14: P5.14 U5.40(I/O19)
NetP5_16: P5.16 U5.41(I/O20)
NetQ1_1: Q1.1(D) R67.2
NetQ1_3: Q1.3(G) R57.2
NetR16_1: R16.1 U1.71(PA25/TWD/IRQ2) U15.5(SDA)
NetR17_1: R17.1 U1.72(PA26/TWCK/IRQ1) U15.6(SCL)
NetR19_2: R19.2 U16.27(AN_1/LED_SPEED)
NetR25_1: R25.1 R32.2 U17.10(MICIN-)
NetR25_2: R25.2 U17.9(MICGAIN+)
NetR26_2: R26.2 R31.1 U17.11(MICIN+)
NetR28_2: R28.2 U16.21(RSVD2)
NetR29_2: R29.2 U16.20(RSVD1)
NetR31_2: R31.2 U17.12(MICGAIN-)
NetR40_1: R40.1 U16.24(RBIAS)
NetR47_1: R47.1 R48.2 REG_1V8.1(GND/Adj)
NetR49_1: R49.1 R50.2 REG_5V.1(GND/Adj)
NetR51_1: R51.1 R52.2 REG_3V3.1(GND/Adj)
NetR53_1: R53.1 R54.2 REG_3V.1(GND/Adj)
NetR55_1: R55.1 U20.27(RAS)
NetR56_1: R56.1 U20.2(CAS)
NetR57_1: R57.1 U3.5(PFO)
NetR58_2: R58.2 REG_1V8.3(Vin)
NetR59_1: R59.1 U16.7(~{PWR_DOWN}/INT)
NetR60_1: R60.1 REG_5V.3(Vin)
NetR61_1: R61.1 REG_3V3.3(Vin)
NetR62_1: R62.1 REG_3V.3(Vin)
NetR63_1: R63.1 R64.2 U17.13(LINSEL)
NetR65_1: R65.1 SW_RESET.1
NetU1_171: U1.171(NWR0/NWE/CFWE) U8.46(1A2)
NetU1_172: U1.172(NWR1/NBS1/CFIOR) U8.44(1A3)

Not connected (* = marked no-connect by the designer): J2 B(RINGSW) C(TIPSW); J3 B(RINGSW) C(TIPSW); J4 SWITCH; P1 2; P5 1 3 5 7 9 11 13; P6 11 13 15; U1 2(PC25/D25) 15(PC14) 16(PC15) 17(PC0/BFCK) 18(PC1/BFRDY/SMOE) 21(PC2/BFAVD) 22(PC3/BFBAA/SMWE) 23(PC4/BFOE) 24(PC5/BFWE) 42(PA0/MISO/PCK3) 61(PA17/TXD0/TIOA0) 64(PA18/RXD0/TIOB0) 65(PA19/SCK0/TIOA1) 66(PA20/CTS0/TIOB1) 67(PA21/RTS0/TIOA2) 68(PA22/RXD2/TIOB2) 69(PA23/TXD2/IRQ3) 73(PA27/MCCK/TCLK3) 74(PA28/MCCDA/TCLK4) 77(PA29/MCCA0/TCLK5) 78(PA30/DRXD/CTS2) 79(BMS/PA31/DTXD/RTS2) 84(PB4/RK0/MCDA2) 85(PB5/RF0/MCDA3) 86(PB6/TF1/TIOA3) 87(PB7/TK1/TIOB3) 88(PB8/TD1/TIOA4) 89(PB9/RD1/TIOB4) 90(PB10/RK1/TIOA5) 91(PB11/RF1/TIOB5) 102(PB20/TXD1) 103(PB21/RXD1) 104(PB22/SCK1) 118(PB23/DCD1) 119(PB24/CTS1) 120(PB25/DSR1/EF100) 121(PB26/RTS1) 123(PB28/FIQ) 124(PB29/IRQ0) 125(HDMA) 126(HDPA) 127(DDM) 128(DDP) 144(SDA10) 158(A20) 159(A21) 160(A22) 161(PC7/A23) 162(PC8/A24) 163(PC9/A25/CFRNW) 173(NWR3/NBS3/CFIOW) 174(SDCK) 175(SDCKE) 176(RAS) 177(CAS) 178(SDWE) 201(PC16/D16) 202(PC17/D17) 203(PC18/D18) 204(PC19/D19) 205(PC20/D20) 206(PC21/D21) 207(PC22/D22) 208(PC23/D23); U3 6(WDI) 8(WDO); U5 2(IN3/GOE0) 3(I/O24) 4(I/O25) 5(I/O26) 6(I/O27) 7(I/O28) 8(I/O29) 9(I/O30) 10(I/O31) 42(I/O21) 43(I/O22) 44(I/O23); U8 6(1B4) 43(1A4); U9 12(NC) 13(H) 14(D); U11 3(A) 4(E) 5(F) 6(B) 12(NC); U13 1(ROW1); U16 25(25MHZ_OUT); U18 13(2B1) 14(2B2) 16(2B3) 17(2B4) 19(2B5) 20(2B6) 22(2B7) 23(2B8) 26(2A8) 27(2A7) 29(2A6) 30(2A5) 32(2A4) 33(2A3) 35(2A2) 36(2A1); U19 16(2B3) 17(2B4) 19(2B5) 20(2B6) 22(2B7) 23(2B8); U21 16(2B3) 17(2B4) 19(2B5) 20(2B6) 22(2B7) 23(2B8)

### Buses and harness runs
bus A_3V3_Buf_[0..19]
bus Addr[16..19]
bus D_3V3B[0..15]
bus Data[0..15]
bus NCS3V3B[0..7]
bus NCS[4..7]

### Notes on the sheet
- Bypass Caps for RCT and TCT
- Fin = 20 MHz, DIV = 5, MUL = 22
- 20 pF load capacitance, 8.8 pF on pins
- (near U1) 12.5 pF load capacitance, 8.8 pF on pins
- Fin = 20 MHz, DIV = 5, MUL = 24
- BRINGUP NOTE: Reset net needs to be level shifted
- Reset if 3V3 goes below 2.75 V
- A

### Library data of the parts
C1-C107 = Cap Semi: Capacitor (Semiconductor SIM Model); Published: 8-Jun-2000; LatestRevisionDate: 29-May-2009; LatestRevisionNote: IPC-7351 Footprint Added.; PackageReference: C1206; Publisher: Altium Limited; PackageDescription: Chip Capacitor
DISP1 = SYM-1539121-1
J1 = SI-50170: MagJack SI-50170 Ethernet Jack with LEDs
J2 J3 = PHONEJACK STEREO SW: 3.5mm Stereo Jack with Switches PHONEJACK STEREO SW
J4 = EJ508A
JTAG_SEL P3 = Header 3: Header, 3-Pin; LatestRevisionDate: 17-Jul-2002; LatestRevisionNote: Re-released for DXP Platform.; Publisher: Altium Limited
K1 = KEYPAD4X4: Grayhill 4x4 Keypad
L1-L4 = 742792116: SMD EMI Suppression Ferrite Bead WE-CBF, Z = 500 Ohm; Impedance: 500 Ohm; DatasheetVersion: Dec-2005; PackageReference: SMD-1206; PackageDescription: Chip Inductor, 2-Leads, Body 3.2 x 1.6 mm; PartNumber: 742792116; ComponentLink1Description: Manufacturer URL; ComponentLink1URL: http://www.we-online.com; ComponentLink2Description: Datasheet; ComponentLink2URL: http://www.we-online.de/katalog/media/pdf/742792116.pdf
L5-L7 = LTST-C191KFKT
P1 = Header 10X2: Header, 10-Pin, Dual row; LatestRevisionDate: 17-Jul-2002; LatestRevisionNote: Re-released for DXP Platform.; Publisher: Altium Limited
P2 = Header 4: Header, 4-Pin; LatestRevisionDate: 17-Jul-2002; LatestRevisionNote: Re-released for DXP Platform.; Publisher: Altium Limited
P4-P7 = Header 8X2: Header, 8-Pin, Dual row; LatestRevisionDate: 17-Jul-2002; LatestRevisionNote: Re-released for DXP Platform.; Publisher: Altium Limited
P8 = Header 4X2: Header, 4-Pin, Dual row; LatestRevisionDate: 17-Jul-2002; LatestRevisionNote: Re-released for DXP Platform.; Publisher: Altium Limited
P9 = Header 6: Header, 6-Pin; LatestRevisionDate: 17-Jul-2002; LatestRevisionNote: Re-released for DXP Platform.; Publisher: Altium Limited
Q1 = MMBFJ175LT1: JFET Chopper, P-Channel - Depletion, 3-Pin SOT-23, Tape and Reel; Manufacturer: On Semiconductor; Channel Polarity: P Channel; Ciss Max (pF): 11; Crss Max (pF): 5.5; IDSS Max (uA): 60000; IDSS Min (uA): 7000; V(BR)GSS Min (V): 30; DatasheetVersion: Rev. 5; PackageVersion: Rev. AP, 11/2009; PackageReference: SOT-23-3-318-08; PackageDescription: 3-Pin Small Outline Transistor, Body 2.92 x 1.3 mm, Pitch 0.95 mm; Supplier 1: Digi-Key; Supplier Part Number 1: MMBFJ175LT1OSCT-ND; Packing: Tape and Reel; Mounting Technology: Surface Mount; PartNumber: MMBFJ175LT1; ComponentLink1Description: Manufacturer URL; ComponentLink1URL: http://www.onsemi.com/; ComponentLink2Description: Datasheet; ComponentLink2URL: http://www.onsemi.com/pub_link/Collateral/MMBFJ175LT1-D.PDF; ComponentLink3Description: Package Specification; ComponentLink3URL: http://www.onsemi.cn/pub_link/Collateral/318-08.PDF
Q2 = DMG3420
R1-R57 R59 R63-R70 = Res3: Resistor; Published: 8-Jun-2000; LatestRevisionDate: 29-May-2009; LatestRevisionNote: IPC-7351 Footprint Added.; PackageReference: J1-0603; Publisher: Altium Limited; PackageDescription: Chip Resistor
R58 R60-R62 = Res3: MCR100JZHJ2R2; Published: 8-Jun-2000; LatestRevisionDate: 29-May-2009; LatestRevisionNote: IPC-7351 Footprint Added.; PackageReference: J1-0603; Publisher: Altium Limited; PackageDescription: Chip Resistor
REG_1V8 REG_3V REG_3V3 REG_5V = LM1086: 1.5A Low Dropout Positive Regulator
U1 = AT91RM9200: Atmel ARM
U2 U4 U8 U18 U19 U21 = 74LVT16245: 16-Bit Bus Transceiver
U3 = MAX705: Maxim uP Supervisory Circuit
U5 = ISPLSI1016E: In-System Programmable High Density CPLD
U6 = IDT71V016: 64K x 16 3.3V Static CMOS RAM
U7 = 29LV040: 4 Megabit (512K x 8) CMOS Uniform Sector Flash Memory
U13 = MM74C923: 20-Key Encoder
U15 = 24AA32: I2C Serial EEPROM
U16 = DP83848: PHYTER - Single Port 10/100 Mb/s Ethernet Physical Layer Transceiver
U17 = TLV320AIC1106: PCM Codec
U20 = DRAM1MX8: 1M x 8 DRAM SIMM
X1-X3 = CRYSTAL